# Altium schematic sheet h_bridge.SchDoc
size A4
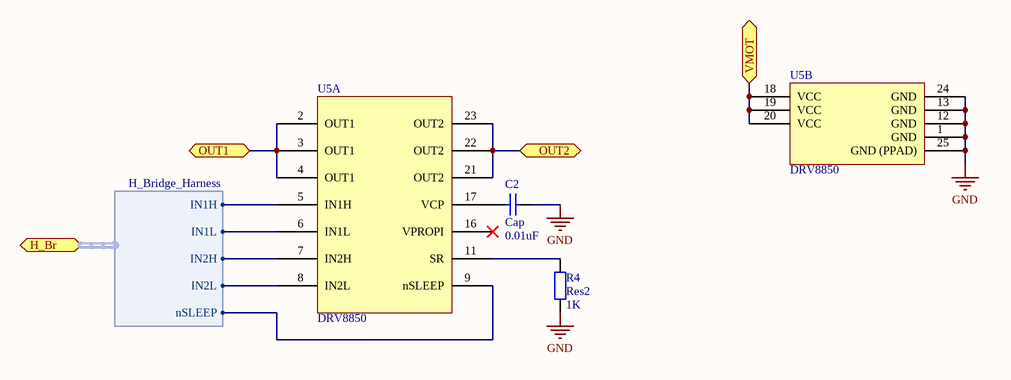
[diagram p0: h_bridge.SchDoc]

## Parts
C2  Cap  value 0.01uF  [RAD-0.3]
R4  Res2  value 1K  [AXIAL-0.4]
U5  DRV8850  (parts A,B of 3)

## Ports
H_Br (harness H_Bridge_Harness), OUT1, OUT2, VMOT

## Harnesses
H_Bridge_Harness: IN1H, IN1L, IN2H, IN2L, nSLEEP

## Nets
GND: C2.2 R4.1 U5.1(GND) U5.12(GND) U5.13(GND) U5.24(GND) U5.25(GND_(PPAD))
OUT1: U5.2(OUT1) U5.3(OUT1) U5.4(OUT1) ; port OUT1
OUT2: U5.21(OUT2) U5.22(OUT2) U5.23(OUT2) ; port OUT2
VMOT: U5.18(VCC) U5.19(VCC) U5.20(VCC) ; port VMOT
NetC2_1: C2.1 U5.17(VCP)
NetR4_2: R4.2 U5.11(SR)
NetU5_5: U5.5(IN1H) ; port H_Br.IN1H
NetU5_6: U5.6(IN1L) ; port H_Br.IN1L
NetU5_7: U5.7(IN2H) ; port H_Br.IN2H
NetU5_8: U5.8(IN2L) ; port H_Br.IN2L
NetU5_9: U5.9(nSLEEP) ; port H_Br.nSLEEP

Not connected (* = marked no-connect by the designer): U5 16(VPROPI)*

## Library data of the parts
C2 = Cap: Capacitor; Published: 8-Jun-2000; LatestRevisionDate: 17-Jul-2002; LatestRevisionNote: Re-released for DXP Platform.; PackageReference: RAD-0.3; Publisher: Altium Limited; PackageDescription: Radial Cap, Thru-Hole; 2 Leads; 0.3 in Pin Spacing
R4 = Res2: Resistor; Published: 8-Jun-2000; LatestRevisionDate: 17-Jul-2002; LatestRevisionNote: Re-released for DXP Platform.; PackageReference: AXIAL-0.4; Publisher: Altium Limited; PackageDescription: Axial Device, Thru-Hole; 2 Leads; 0.4 in Pin Spacing